# EAGLE design ChipStomp v1.1 (EAGLE 6.5.0)
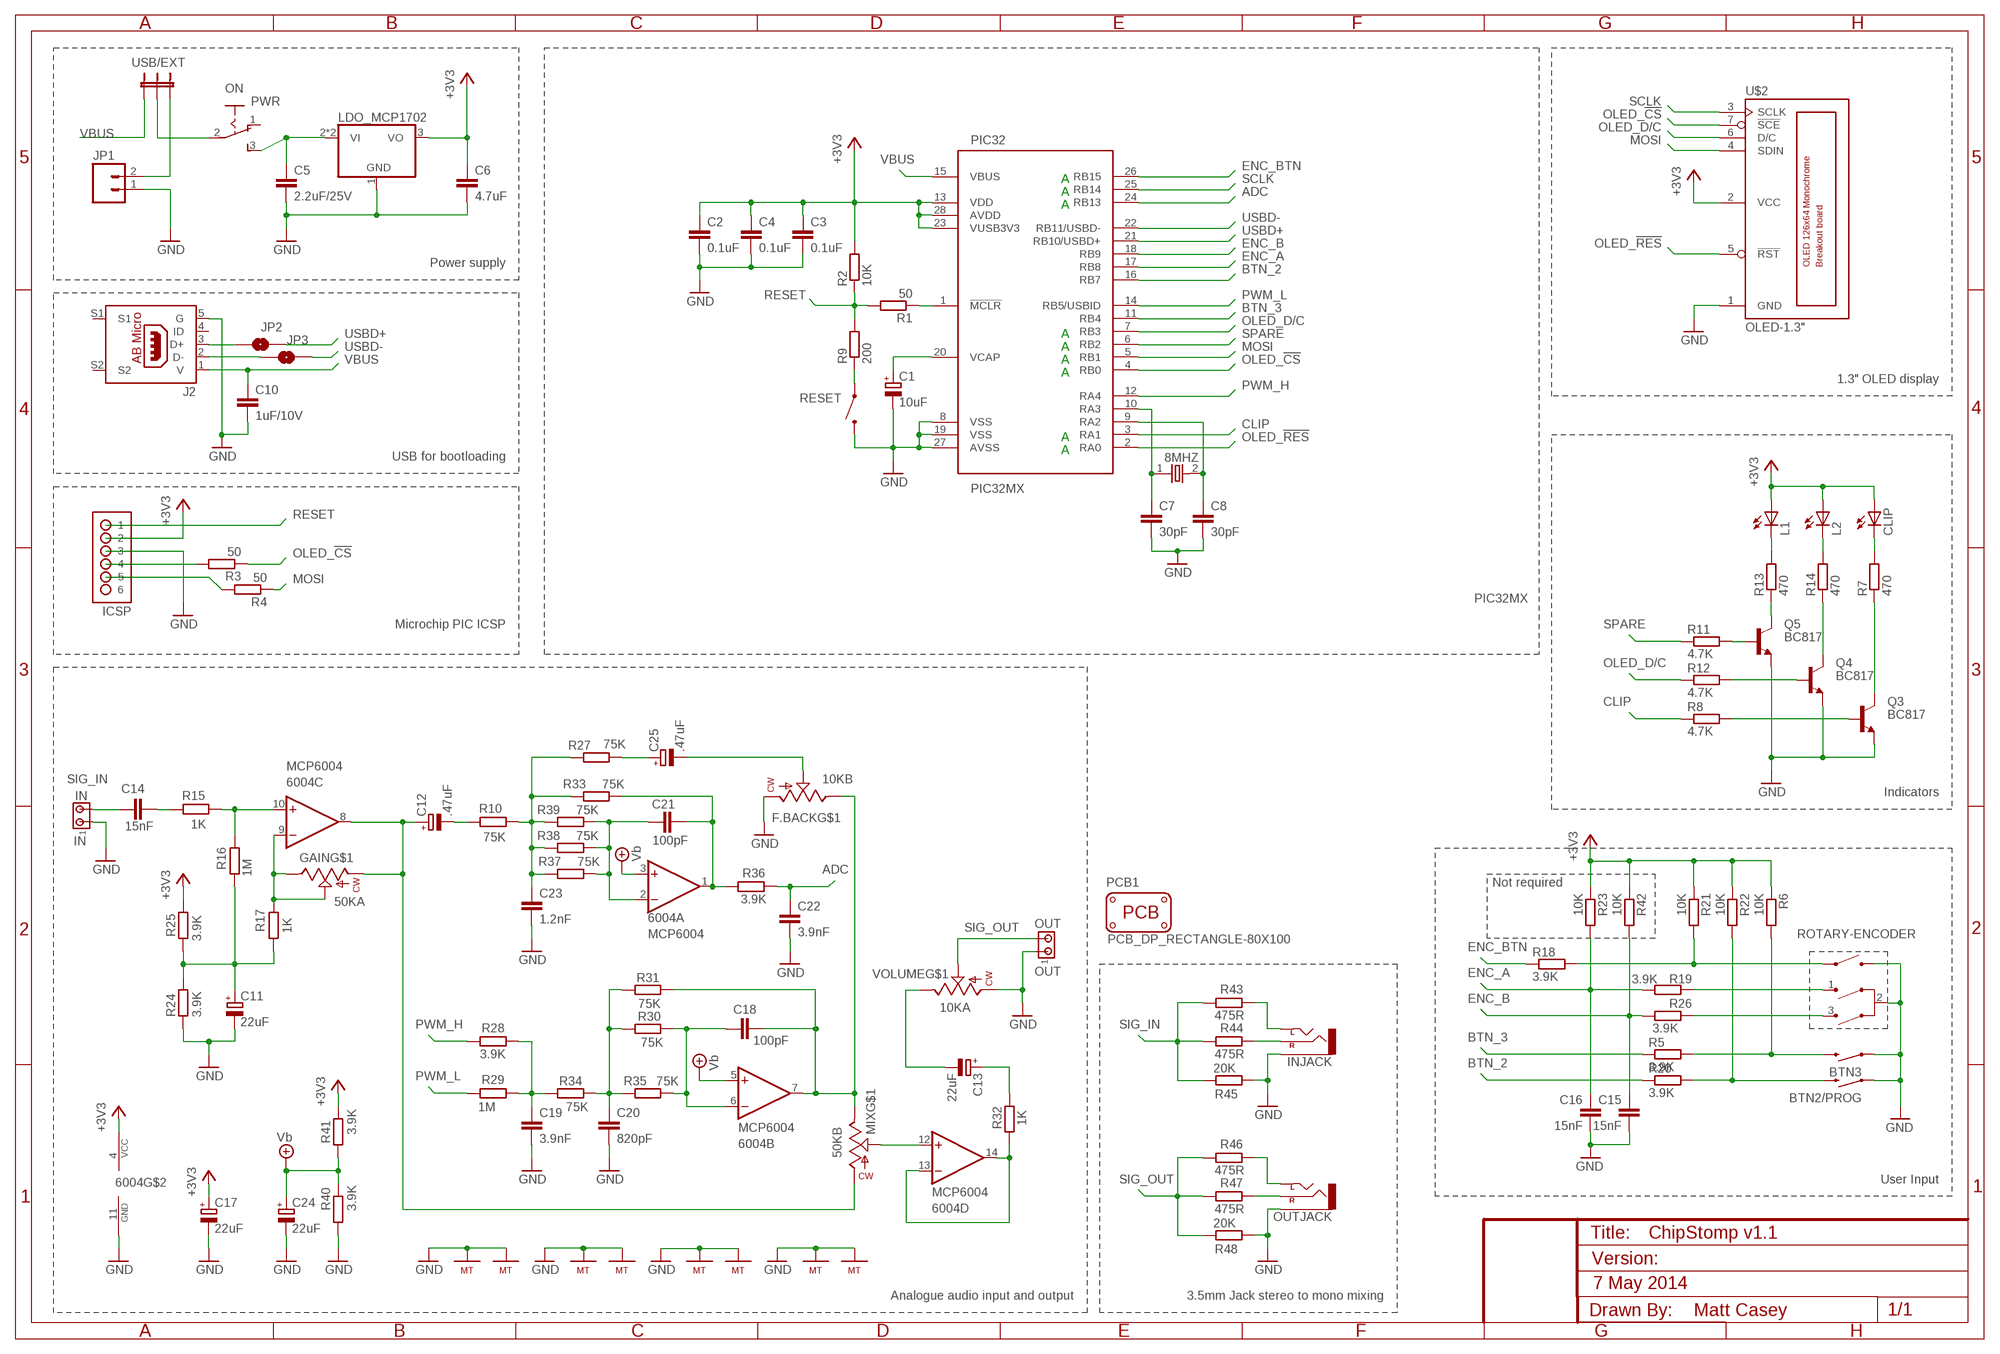
[diagram p0: schematic, sheet 1]

## Parts
8MHZ  OSC-XTAL-HC-49U-SMD  [HC-49U]
6004  MCP6004  [SO-14]
BTN2/PROG  SWITCH-MOMENTARY-212MM  [TACTILE-PTH-12MM]
BTN3  SWITCH-MOMENTARY-212MM  [TACTILE-PTH-12MM]
C1  10uF  CPOL-EUA/3216-18R  [A/3216-18R]
C2  0.1uF  C-EUC0805K  [C0805K]
C3  0.1uF  C-EUC0805K  [C0805K]
C4  0.1uF  C-EUC0805K  [C0805K]
C5  2.2uF/25V  C-EUC0805K  [C0805K]
C6  4.7uF  C-EUC0805K  [C0805K]
C7  30pF  C-EUC0805K  [C0805K]
C8  30pF  C-EUC0805K  [C0805K]
C10  1uF/10V  C-EUC0805K  [C0805K]
C11  22uF  CPOL-EU153CLV-0505  [153CLV-0505]
C12  .47uF  CPOL-EU153CLV-0405  [153CLV-0405]
C13  22uF  CPOL-EU153CLV-0505  [153CLV-0505]
C14  15nF  C-EUC0805K  [C0805K]
C15  15nF  C-EUC0805K  [C0805K]
C16  15nF  C-EUC0805K  [C0805K]
C17  22uF  CPOL-EU153CLV-0505  [153CLV-0505]
C18  100pF  C-EUC0805K  [C0805K]
C19  3.9nF  C-EUC0805K  [C0805K]
C20  820pF  C-EUC0805K  [C0805K]
C21  100pF  C-EUC0805K  [C0805K]
C22  3.9nF  C-EUC0805K  [C0805K]
C23  1.2nF  C-EUC0805K  [C0805K]
C24  22uF  CPOL-EU153CLV-0505  [153CLV-0505]
C25  .47uF  CPOL-EU153CLV-0405  [153CLV-0405]
CLIP  LED-0805  [LED-805]
F.BACK  10KB  POT  [POT/SINGLE/PANASONIC/VERT]
GAIN  50KA  POT  [POT/SINGLE/PANASONIC/VERT]
ICSP  No Load  HDR-1X6-OFFSET  [HDR-1X6_OFFSET]
IN  IN  JMP/2P/SIP  [JMP/2P/SIP]
INJACK  AUDIO-JACKPTH  [STEREO_JACK3.5MM_PTH]
J2  US-AB-MICRO-TH  [WMRU2AB-05FLB2DSR-4.0]
JP1  M023.5MM  [SCREWTERMINAL-3.5MM-2]
JP2  Straight Male  SOLDERJUMPERTRACE  [SJ_2S-TRACE]
JP3  Straight Male  SOLDERJUMPERTRACE  [SJ_2S-TRACE]
L1  LED-0805  [LED-805]
L2  LED-0805  [LED-805]
MIX  50KB  POT  [POT/SINGLE/PANASONIC/VERT]
ON  PWR  DX_MINI_SPDT  [DX_MINI_SPDT_VERTICAL]
OUT  OUT  JMP/2P/SIP  [JMP/2P/SIP]
OUTJACK  AUDIO-JACKPTH  [STEREO_JACK3.5MM_PTH]
PCB1  PCB_DP_RECTANGLE-80X100  [DP10080_V1]
PIC32  PIC32MX  PIC32MX250FXXXB  [SO-28]
Q3  BC817  BC817-16LT1SMD  [SOT23-BEC]
Q4  BC817  BC817-16LT1SMD  [SOT23-BEC]
Q5  BC817  BC817-16LT1SMD  [SOT23-BEC]
R1  50  R-EU_R0805  [R0805]
R2  10K  R-EU_R0805  [R0805]
R3  50  R-EU_R0805  [R0805]
R4  50  R-EU_R0805  [R0805]
R5  3.9K  R-EU_R0805  [R0805]
R6  10K  R-EU_R0805  [R0805]
R7  470  R-EU_R0805  [R0805]
R8  4.7K  R-EU_R0805  [R0805]
R9  200  R-EU_R0805  [R0805]
R10  75K  R-EU_R0805  [R0805]
R11  4.7K  R-EU_R0805  [R0805]
R12  4.7K  R-EU_R0805  [R0805]
R13  470  R-EU_R0805  [R0805]
R14  470  R-EU_R0805  [R0805]
R15  1K  R-EU_R0805  [R0805]
R16  1M  R-EU_R0805  [R0805]
R17  1K  R-EU_R0805  [R0805]
R18  3.9K  R-EU_R0805  [R0805]
R19  3.9K  R-EU_R0805  [R0805]
R20  3.9K  R-EU_R0805  [R0805]
R21  10K  R-EU_R0805  [R0805]
R22  10K  R-EU_R0805  [R0805]
R23  10K  R-EU_R0805  [R0805]
R24  3.9K  R-EU_R0805  [R0805]
R25  3.9K  R-EU_R0805  [R0805]
R26  3.9K  R-EU_R0805  [R0805]
R27  75K  R-EU_R0805  [R0805]
R28  3.9K  R-EU_R0805  [R0805]
R29  1M  R-EU_R0805  [R0805]
R30  75K  R-EU_R0805  [R0805]
R31  75K  R-EU_R0805  [R0805]
R32  1K  R-EU_R0805  [R0805]
R33  75K  R-EU_R0805  [R0805]
R34  75K  R-EU_R0805  [R0805]
R35  75K  R-EU_R0805  [R0805]
R36  3.9K  R-EU_R0805  [R0805]
R37  75K  R-EU_R0805  [R0805]
R38  75K  R-EU_R0805  [R0805]
R39  75K  R-EU_R0805  [R0805]
R40  3.9K  R-EU_R0805  [R0805]
R41  3.9K  R-EU_R0805  [R0805]
R42  10K  R-EU_R0805  [R0805]
R43  475R  R-EU_R0805  [R0805]
R44  475R  R-EU_R0805  [R0805]
R45  20K  R-EU_R0805  [R0805]
R46  475R  R-EU_R0805  [R0805]
R47  475R  R-EU_R0805  [R0805]
R48  20K  R-EU_R0805  [R0805]
RESET  TINY_TACTILEPTH  [TINY_TACTILE_PTH]
SW1  ROTARY-ENCODER  [SURE]
U$2  OLED-1.3"  OLED-130-BREAKOUT2HOLES  [OLED-130-BREAKOUT_2HOLES]
U$3  LDO_MCP1702  LDO_MCP1702SOT89  [SOT89]
USB/EXT  JUMPER-3PTH  [1X03]
VOLUME  10KA  POT  [POT/SINGLE/PANASONIC/VERT]

## Nets
+3V3: 6004.4(VCC) C2.1 C3.1 C4.1 C6.1 C17.+ CLIP.A ICSP.2 L1.A L2.A PIC32.13(VDD) PIC32.23(VUSB3V3) PIC32.28(AVDD) R2.2 R6.1 R21.1 R22.1 R23.1 R25.1 R41.1 R42.1 U$2.2(VCC) U$3.3(VO)
ADC: C22.1 PIC32.24(RB13) R36.1
BTN_2: PIC32.16(RB7) R20.1
BTN_3: PIC32.11(RB4) R5.1
CLIP: PIC32.3(RA1) R8.1
ENC_A: C16.1 PIC32.17(RB8) R19.1 R23.2
ENC_B: C15.1 PIC32.18(RB9) R26.1 R42.2
ENC_BTN: PIC32.26(RB15) R18.1
GND: 6004.11(GND) BTN2/PROG.1 BTN3.1 C1.- C2.2 C3.2 C4.2 C5.2 C6.2 C7.2 C8.2 C10.2 C11.- C15.2 C16.2 C17.- C19.2 C20.2 C22.2 C23.2 C24.- F.BACK.P$1 F.BACK.P$4(MT) F.BACK.P$5(MT) GAIN.P$4(MT) GAIN.P$5(MT) ICSP.3 IN.1 INJACK.S(SLEEVE) INJACK.S@1(SLEEVE) J2.5(G) JP1.1 MIX.P$4(MT) MIX.P$5(MT) OUT.1 OUTJACK.S(SLEEVE) OUTJACK.S@1(SLEEVE) PIC32.8(VSS) PIC32.19(VSS) PIC32.27(AVSS) Q3.E Q4.E Q5.E R24.2 R40.2 R45.2 R48.2 RESET.2(B) SW1.2(A:COMMON) SW1.A(B:B) U$2.1(GND) U$3.1(GND) VOLUME.P$1 VOLUME.P$4(MT) VOLUME.P$5(MT)
MOSI: PIC32.5(RB1) R4.1 U$2.4(SDIN)
N$1: PIC32.1(!MCLR) R1.1
N$3: BTN3.3 R5.2 R6.2
N$4: Q3.C R7.1
N$5: Q3.B R8.2
N$6: CLIP.C R7.2
N$7: INJACK.L(LEFT) INJACK.L@1(LEFT) R43.1
N$8: INJACK.R(RIGHT) R44.1
N$9: ON.2(P) USB/EXT.2
N$10: OUTJACK.L(LEFT) OUTJACK.L@1(LEFT) R46.1
N$11: R9.1 RESET.1(A)
N$12: C1.+ PIC32.20(VCAP)
N$13: OUTJACK.R(RIGHT) R47.1
N$15: C14.2 R15.2
N$16: JP1.2 USB/EXT.3
N$17: 6004.10(C:+IN) R15.1 R16.2
N$18: Q5.B R11.2
N$19: Q5.C R13.1
N$20: Q4.C R14.1
N$21: Q4.B R12.2
N$22: 6004.8(C:OUT) C12.+ GAIN.P$1 MIX.P$1
N$23: J2.2(D-) JP3.1
N$25: 6004.9(C:-IN) GAIN.P$2 GAIN.P$3 R17.2
N$26: L1.C R13.2
N$27: L2.C R14.2
N$28: C12.- R10.2
N$29: R18.2 R21.2 SW1.B(B:A)
N$30: BTN2/PROG.3 R20.2 R22.2
N$31: C23.1 R10.1 R27.2 R33.2 R37.2 R38.2 R39.2
N$32: 6004.2(A:-IN) C21.1 R37.1 R38.1 R39.1
N$33: 6004.1(A:OUT) C21.2 R33.1 R36.2
N$34: C11.+ R16.1 R17.1 R24.1 R25.2
N$35: C19.1 R28.1 R29.1 R34.2
N$36: C20.1 R30.2 R31.2 R34.1 R35.2
N$37: 6004.6(B:-IN) C18.1 R30.1 R35.1
N$38: C25.+ R27.1
N$39: 6004.7(B:OUT) C18.2 F.BACK.P$3 MIX.P$3 R31.1
N$40: C13.+ R32.1
N$41: C13.- VOLUME.P$3
N$43: R19.2 SW1.1(A:SIG1)
N$44: R26.2 SW1.3(A:SIG2)
N$45: C25.- F.BACK.P$2
N$47: 6004.12(D:+IN) MIX.P$2
N$48: 6004.13(D:-IN) 6004.14(D:OUT) R32.2
OLED_!CS: PIC32.4(RB0) R3.1 U$2.7(!SCE)
OLED_!RES: PIC32.2(RA0) U$2.5(!RST)
OLED_D/C: PIC32.7(RB3) R12.1 U$2.6(D/C)
OSC1/CLKI/RPA2/RA2: 8MHZ.2 C8.1 PIC32.9(RA2)
OSC2/CLKO/RPA3/PMA0/RA3: 8MHZ.1 C7.1 PIC32.10(RA3)
PGC: ICSP.5 R4.2
PGD: ICSP.4 R3.2
PWM_H: PIC32.12(RA4) R28.2
PWM_L: PIC32.14(RB5/USBID) R29.2
RESET: ICSP.1 R1.2 R2.1 R9.2
SCLK: PIC32.25(RB14) U$2.3(SCLK)
SIG_IN: C14.1 IN.2 R43.2 R44.2 R45.1
SIG_OUT: OUT.2 R46.2 R47.2 R48.1 VOLUME.P$2
SPARE: PIC32.6(RB2) R11.1
USBD+: J2.3(D+) JP2.1 JP2.2 PIC32.21(RB10/USBD+)
USBD-: JP3.2 PIC32.22(RB11/USBD-)
VBUS: C10.1 J2.1(V) PIC32.15(VBUS) USB/EXT.1
VIN: C5.1 ON.3(S) U$3.2(VI) U$3.4(VI)
VREF: 6004.3(A:+IN) 6004.5(B:+IN) C24.+ R40.1 R41.2 ; supply symbol labelled Vb
Unconnected: ICSP.6 J2.4(ID) J2.S1 J2.S2 ON.1(O)

## Notes on the sheet
- A
- A
- A
- Power supply
- A
- A
- A
- A
- 1.3" OLED display
- A
- A
- USB for bootloading
- PIC32MX
- Microchip PIC ICSP
- Indicators
- Not required
- User Input
- 7 May 2014
- Analogue audio input and output | 3.5mm Jack stereo to mono mixing
- Matt Casey

## Library data of the parts
8MHZ = dp_devices:OSC-XTAL
6004 = Catmacey:MCP6004
BTN2/PROG BTN3 = SparkFun:SWITCH-MOMENTARY-2
C1 C11-C13 C17 C24 C25 = rcl:CPOL-EU: POLARIZED CAPACITOR, European symbol
C2-C8 C10 C14-C16 C18-C23 = rcl:C-EU: CAPACITOR, European symbol
CLIP L1 L2 = dp_devices:LED: Light Emitting Diode
F.BACK GAIN MIX VOLUME = audioint:POT
ICSP = Mechanical:HDR-1X6-OFFSET: 42 mil hole pattern with 16mil offset for jtag connector
IN OUT = audioint:JMP/2P/SIP
INJACK OUTJACK = Catmacey:AUDIO-JACK: 3.5mm Audio Jack Simple 3.5mm common PCB mount audio jack. SKU: PRT-08032
J2 = Mechanical:US-AB-MICRO-TH: Through-hole USB-AB-MICRO connector
JP1 = SparkFun:M02: Header 2 Standard 2-pin 0.1" header. Use with straight break away headers (SKU : PRT-00116), right angle break away headers (PRT-00553), swiss pins (PRT-00743), machine pins (PRT-00117), and female headers (PRT-00115). Molex polarized connector foot print use with SKU : PRT-08233 with associated crimp pins and housings.
JP2 JP3 = SparkFun:SOLDERJUMPER: Solder Jumper Standard SMD solder jumper. Used to automate production. Two varients : Normally Open and Normally Closed are the same, but have different paste layers. NC will have a large amount of paste and should jumper during reflow.
ON = Catmacey:DX_MINI_SPDT: SLIDING SWITCH SPDT Odd pin spacing 4.8mm bought from Deal Extreme Here <http://dx.com/p/3-pin-slide-switch-diy-parts-black-silver-20-piece-pack-134100?item=276>
PCB1 = dp_devices:PCB_DP_RECTANGLE: Dangerous Prototypes Standard Rectangular PCB sizes
PIC32 = Catmacey:PIC32MX250FXXXB
Q3-Q5 = transistor-npn:BC817*: NPN Transistor
R1-R48 = rcl:R-EU_: RESISTOR, European symbol
RESET = Catmacey:TINY_TACTILE: DIL/CODE SWITCH
SW1 = Catmacey:ROTARY-ENCODER: 11mm Incemental Encoder Source: www.piher.net .. 04-CI-11v04.pdf
U$2 = Catmacey:OLED-130-BREAKOUT
U$3 = Catmacey:LDO_MCP1702
USB/EXT = SparkFun:JUMPER-3

## Board
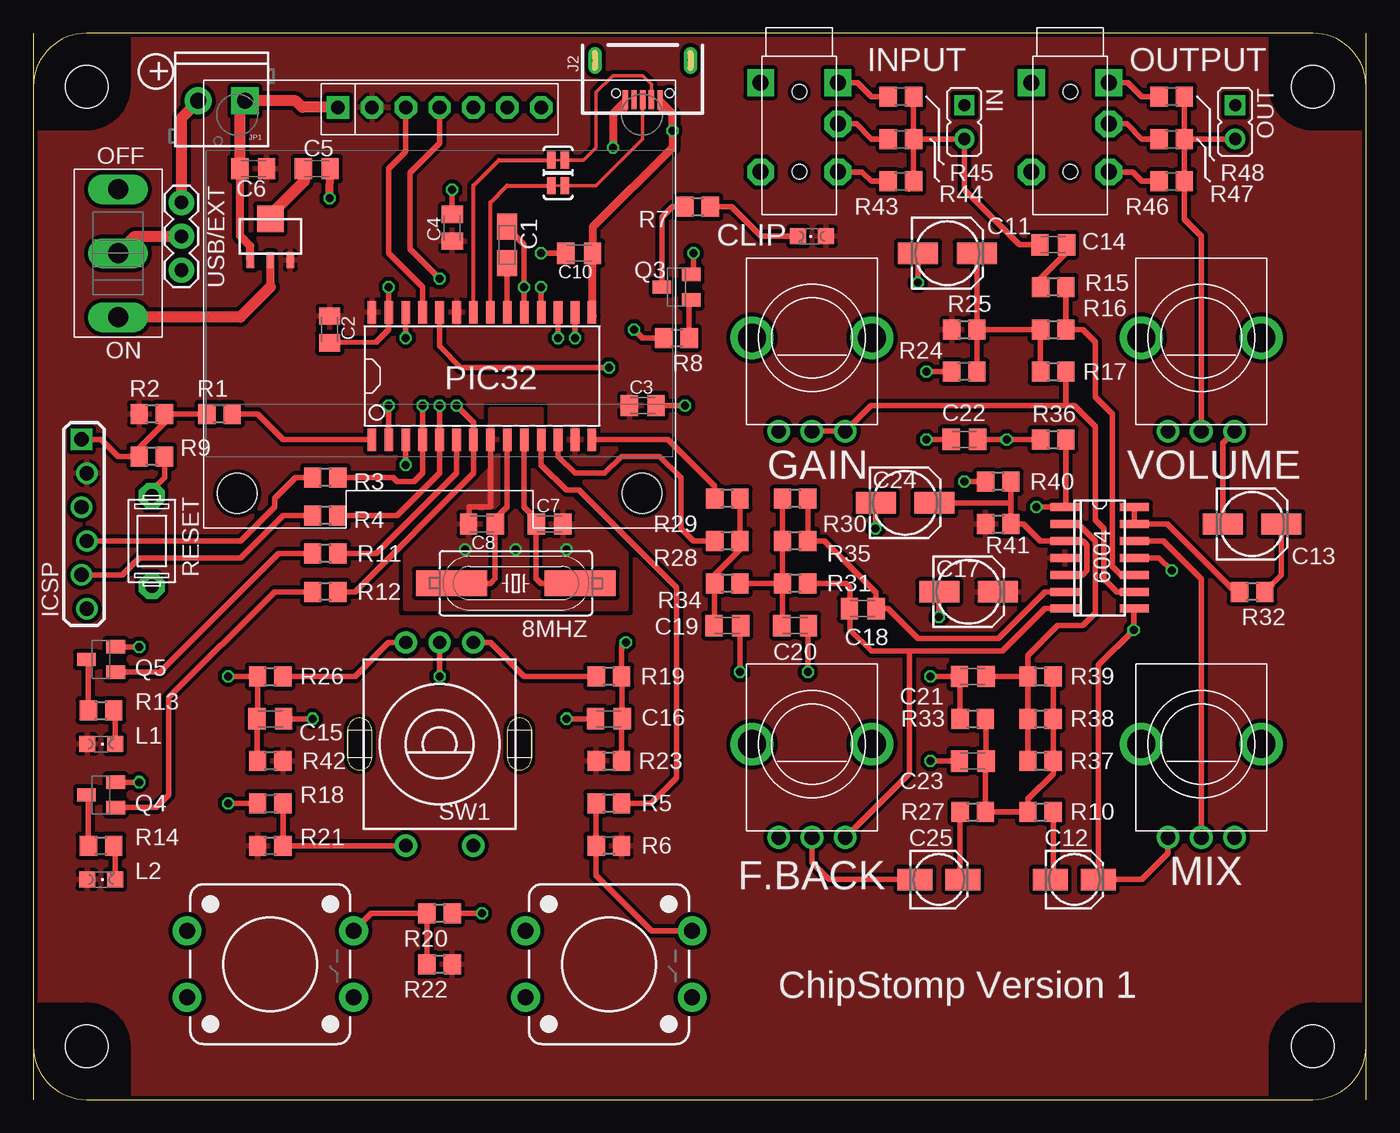
[diagram p1: board, top side]
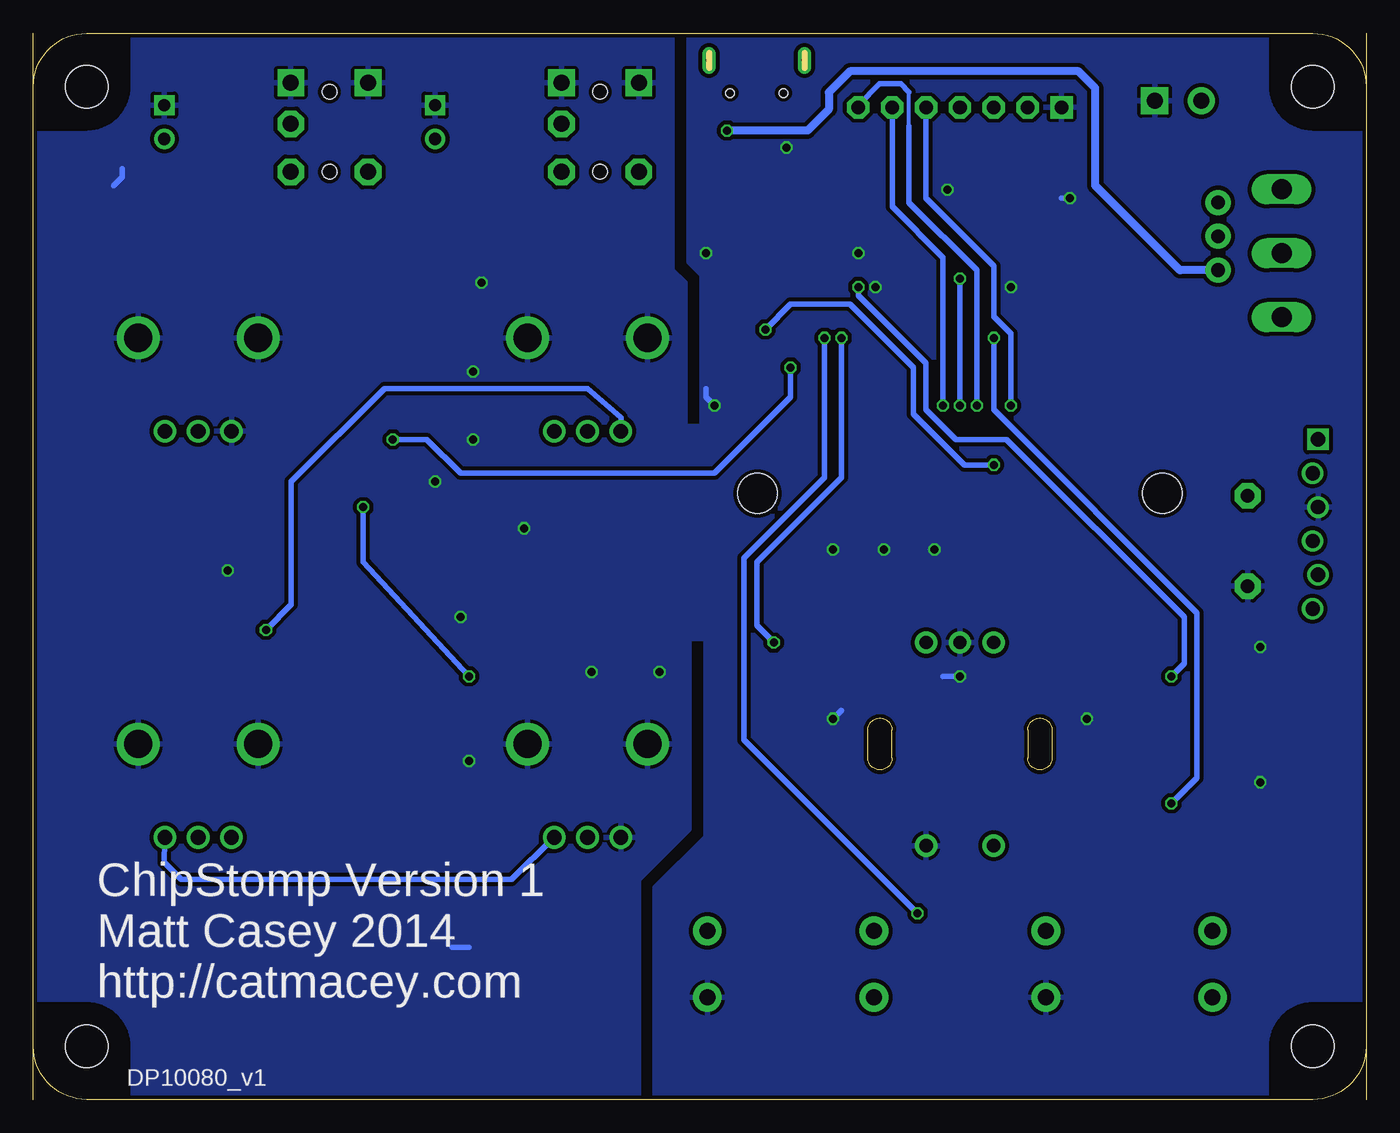
[diagram p2: board, bottom side, seen from below]

Size 100 x 80 mm. Coordinates in mm from the lower left corner, seen from the top.
Outline: 100,0 100,80
Outline: 0,80 0,0
Copper layers (1*16): Top 0.035mm / dielectric 1.5mm / Bottom 0.035mm
Design rules "dirt_cheap_dirty_boards.v1": minimum track width 5mil, minimum drill 12mil, track to track 5mil, track to pad 5mil, pad to pad 5mil, via to via 5mil, smd to smd 0mil, copper to edge 10mil, drill to drill 10mil, minimum pad ring 10mil, minimum via ring 6mil, stop-mask expansion 2mil, vias tented up to drill 25mil, thermal gap 10mil

### Footprints (pad centres in the part's own frame; a part is rotated, then mirrored left to right if it is on the bottom)
HC-49U = smd 5.334 x 1.93: 1 -4.826,0; 2 4.826,0
SO-14 = smd 0.6 x 2.2: 1 -3.81,-2.6; 2 -2.54,-2.6; 3 -1.27,-2.6; 4 0,-2.6; 5 1.27,-2.6; 6 2.54,-2.6; 7 3.81,-2.6; 8 3.81,2.6; 9 2.54,2.6; 10 1.27,2.6; 11 0,2.6; 12 -1.27,2.6; 13 -2.54,2.6; 14 -3.81,2.6
TACTILE-PTH-12MM = drill 1.2 pad 2.159: 1 6.25,-2.5; 2 -6.25,-2.5; 3 6.25,2.5; 4 -6.25,2.5
A/3216-18R = smd 1.95 x 1.5: + 1.375,0; - -1.375,0
C0805K = smd 1.3 x 1.6: 1 -1,0; 2 1,0
153CLV-0505 = smd 3 x 1.6: + 2.2,0; - -2.2,0
153CLV-0405 = smd 2.6 x 1.6: + 1.8,0; - -1.8,0
LED-805 = smd 1.2 x 1.2: A 0,-1.05; C 0,1.05
POT/SINGLE/PANASONIC/VERT = drill 1.092 pad 1.7: P$1 -2.5,-7; P$2 0,-7; P$3 2.5,-7 | drill 2.108 pad 3.2: P$4 -4.5,0; P$5 4.5,0
HDR-1X6_OFFSET = drill 1.067 square: 1 -0.203,6.35 | drill 1.067: 2 0.203,3.81; 3 -0.203,1.27; 4 0.203,-1.27; 5 -0.203,-3.81; 6 0.203,-6.35
JMP/2P/SIP = drill 0.914 pad 1.524 square: 1 -1.27,0 | drill 0.914 pad 1.524: 2 1.27,0
STEREO_JACK3.5MM_PTH = drill 1.2 pad 2 octagon: L -2.9,-6.6; L@1 2.9,-6.6; R 2.9,-3 | drill 1.2 pad 2 square: S -2.9,0.1; S@1 2.9,0.1 | hole 1.1: 0,-6.6; 0,-0.6
WMRU2AB-05FLB2DSR-4.0 = smd 0.4 x 1.4: 1 -1.3,1.5; 2 -0.65,1.5; 3 0,1.5; 4 0.65,1.5; 5 1.3,1.5 | drill 0.45 pad 1 long: S1 -3.58,-1.45; S2 3.58,-1.45 | hole 0.65: -2,1; 2,1
SCREWTERMINAL-3.5MM-2 = drill 1.2 pad 2.032 square: 1 0,0 | drill 1.2 pad 2.032: 2 3.5,0
SJ_2S-TRACE = smd 0.635 x 1.27: 1 -0.508,0; 2 0.508,0
DX_MINI_SPDT_VERTICAL = drill 1.5 long: 1 -4.8,0; 2 0,0; 3 4.8,0
DP10080_V1 = hole 3.2: 4,4; 96,4; 96,76; 4,76
SO-28 = smd 0.65 x 1.7: 1 -8.89,-4.78; 2 -7.62,-4.78; 3 -6.35,-4.78; 4 -5.08,-4.78; 5 -3.81,-4.78; 6 -2.54,-4.78; 7 -1.27,-4.78; 8 0,-4.78; 9 1.27,-4.78; 10 2.54,-4.78; 11 3.81,-4.78; 12 5.08,-4.78; 13 6.35,-4.78; 14 7.62,-4.78; 15 7.62,4.78; 16 6.35,4.78; 17 5.08,4.78; 18 3.81,4.78; 19 2.54,4.78; 20 1.27,4.78; 21 0,4.78; 22 -1.27,4.78; 23 -2.54,4.78; 24 -3.81,4.78; 25 -5.08,4.78; 26 -6.35,4.78; 27 -7.62,4.78; 28 -8.89,4.78
SOT23-BEC = smd 1 x 1.4: B -0.95,-1.1; C 0,1.1; E 0.95,-1.1
R0805 = smd 1.3 x 1.5: 1 -0.95,0; 2 0.95,0
TINY_TACTILE_PTH = drill 1.016 pad 1.93 octagon: 1 0,-3.393; 2 0,3.393
SURE = drill 1 pad 1.676: 1 -2.54,-7.62; 2 0,-7.62; 3 2.54,-7.62; A -2.54,7.62; B 2.54,7.62
OLED-130-BREAKOUT_2HOLES = drill 1.016 pad 1.676 square: 1 -7.62,14.75 | drill 1.016 pad 1.676 octagon: 2 -5.08,14.75; 3 -2.54,14.75; 4 0,14.75; 5 2.54,14.75; 6 5.08,14.75; 7 7.62,14.75 | hole 3: -15.19,-14.21; 15.19,-14.21
SOT89 = smd 0.58 x 1.2: 1 -1.5,-1.8; 2 0,-1.8; 3 1.5,-1.8 | smd 2 x 2: 4 0,1.3
1X03 = drill 1.016 pad 1.88: 1 0,0; 2 2.54,0; 3 5.08,0

### Placement (x,y rotation side)
8MHZ  36.2,38.73 180 top
6004  80.01,40.64 270 top
BTN2/PROG  17.78,10.16 0 top
BTN3  43.18,10.16 0 top
C1  35.56,64.14 270 top
C2  22.23,57.78 270 top
C3  45.72,52.07 0 top
C4  31.43,65.41 90 top
C5  21.27,69.85 0 top
C6  16.51,69.85 180 top
C7  38.73,43.18 0 top
C8  33.66,43.18 180 top
C10  40.96,63.5 180 top
C11  68.58,63.5 0 top
C12  78.11,16.51 0 top
C13  91.44,43.18 0 top
C14  76.52,64.14 0 top
C15  17.78,28.57 0 top
C16  43.18,28.57 180 top
C17  70.17,38.1 0 top
C18  62.23,36.83 180 top
C19  52.07,35.56 0 top
C20  57.15,35.56 0 top
C21  70.48,31.75 180 top
C22  69.85,49.53 180 top
C23  70.48,25.4 180 top
C24  65.41,44.77 0 top
C25  67.94,16.51 0 top
CLIP  58.42,64.77 90 top
F.BACK  58.42,26.67 0 top
GAIN  58.42,57.15 0 top
ICSP  3.81,43.18 0 top
IN  69.85,73.34 270 top
INJACK  57.47,76.2 0 top
J2  45.72,76.52 180 top
JP1  15.88,74.93 180 top
JP2  39.37,68.58 180 top
JP3  39.37,70.48 180 top
L1  5.08,26.67 270 top
L2  5.08,16.51 270 top
MIX  87.63,26.67 0 top
ON  6.35,63.5 270 top
OUT  90.17,73.34 270 top
OUTJACK  77.79,76.2 0 top
PCB1  0,0 0 top
PIC32  34.29,54.29 0 top
Q3  48.26,60.96 90 top
Q4  5.08,22.86 90 top
Q5  5.08,33.02 90 top
R1  13.97,51.44 180 top
R2  8.89,51.44 180 top
R3  21.91,46.67 180 top
R4  21.91,43.81 180 top
R5  43.18,22.23 180 top
R6  43.18,19.05 180 top
R7  49.85,66.99 0 top
R8  48.26,57.15 0 top
R9  8.89,48.26 180 top
R10  75.56,21.59 0 top
R11  21.91,40.96 180 top
R12  21.91,38.1 180 top
R13  5.08,29.21 0 top
R14  5.08,19.05 0 top
R15  76.52,60.96 180 top
R16  76.52,57.78 0 top
R17  76.52,54.61 0 top
R18  17.78,22.23 0 top
R19  43.18,31.75 180 top
R20  30.48,13.97 180 top
R21  17.78,19.05 0 top
R22  30.48,10.16 180 top
R23  43.18,25.4 0 top
R24  69.85,54.61 180 top
R25  69.85,57.78 0 top
R26  17.78,31.75 0 top
R27  70.48,21.59 0 top
R28  52.07,41.91 180 top
R29  52.07,45.09 180 top
R30  57.15,45.09 180 top
R31  57.15,38.73 180 top
R32  91.44,38.1 180 top
R33  70.48,28.57 0 top
R34  52.07,38.73 180 top
R35  57.15,41.91 180 top
R36  76.52,49.53 0 top
R37  75.56,25.4 0 top
R38  75.56,28.57 0 top
R39  75.56,31.75 0 top
R40  72.39,46.35 180 top
R41  72.39,43.18 0 top
R42  17.78,25.4 180 top
R43  65.09,68.9 0 top
R44  65.09,72.07 0 top
R45  65.09,75.25 180 top
R46  85.41,68.9 0 top
R47  85.41,72.07 0 top
R48  85.41,75.25 180 top
RESET  8.89,41.91 180 top
SW1  30.48,26.67 180 top
U$2  30.48,59.69 0 top
U$3  17.78,64.77 0 top
USB/EXT  11.11,62.23 90 top
VOLUME  87.63,57.15 0 top

### Tracks (layer width: path | path; a pad name or v marks a point on that pad's centre or on a via)
+3V3
  pour Top (isolate 0.305, rank 6): 0,80.01 49.53,80.01 51.44,80.01 99.69,80.01 100.33,0 55.88,0 54.61,0 0,0
ADC  (via drill 0.6)
  Top 0.406: C22.1 v73.03,49.53 R36.1 | v43.18,54.93 32.07,54.93 30.48,56.52 PIC32.24
  Bottom 0.406: v43.18,54.93 43.18,52.7 48.9,46.99 67.94,46.99 70.48,49.53 v73.03,49.53
BTN_2  (via drill 0.6)
  Top 0.406: PIC32.16 v40.64,57.15 | v33.66,13.97 R20.1
  Bottom 0.406: v40.64,57.15 40.64,46.67 46.67,40.64 46.67,26.99 v33.66,13.97
BTN_3
  Top 0.406: PIC32.11 38.1,47.62 40.01,45.72 40.96,45.72 48.26,38.42 48.26,24.13 46.35,22.23 R5.1
CLIP  (via drill 0.6)
  Top 0.406: R8.1 45.72,57.15 v45.09,57.78 | PIC32.3 v27.94,47.62
  Bottom 0.406: v27.94,47.62 30.16,47.62 33.97,51.44 33.97,54.93 38.73,59.69 43.18,59.69 v45.09,57.78
ENC_A  (via drill 0.6)
  Top 0.406: PIC32.17 v39.37,57.15 | R23.2 44.13,28.52 C16.1 44.18,31.7 R19.1 44.13,33.97 v44.45,34.29
  Bottom 0.406: v39.37,57.15 39.37,46.67 45.72,40.32 45.72,35.56 v44.45,34.29
ENC_B  (via drill 0.6)
  Top 0.406: R42.2 16.78,25.45 C15.1 16.83,28.62 R26.1 v14.61,31.75 | PIC32.18 v38.1,60.96
  Bottom 0.406: v38.1,60.96 38.1,60.33 33.02,55.24 33.02,51.75 30.8,49.53 26.99,49.53 13.65,36.2 13.65,32.7 v14.61,31.75
ENC_BTN  (via drill 0.6)
  Top 0.406: PIC32.26 v27.94,57.15 | R18.1 v14.61,22.23
  Bottom 0.406: v14.61,22.23 12.7,24.13 12.7,36.51 27.94,51.75 v27.94,57.15
GND  (via drill 0.6)
  Top 0.305: 44.45,74.61 44.13,74.3 | 44.45,74.3 44.13,74.3 | 44.13,74.3 43.5,73.66
  Top 0.406: v67.31,25.4 C23.2 | C22.2 v66.99,49.53 | C17.- 67.94,38.12 v67.94,36.2 | R40.2 v69.85,46.35 | C24.- 63.18,44.74 v63.18,42.86 | C20.2 58.1,35.51 v58.1,32.07 | 6004.11 84.45,40.64 v85.41,39.69 | R24.2 v66.99,54.61 | C11.- 66.36,63.16 v66.36,61.28 | PIC32.8 34.29,44.45 32.7,44.45 32.7,43.23 C8.2 | C10.2 v38.1,63.5 | C5.2 21.91,69.8 | 32.66,41.32 32.7,41.27 | PIC32.19 v36.83,60.96 36.83,64.14 35.56,65.41 C1.- | v26.67,60.96 PIC32.27 26.67,57.78 25.72,56.83 C2.2 | C4.2 v31.43,68.26 | SW1.2 v30.48,31.75 | v20.95,28.57 C15.2 | C16.2 v40.01,28.57 | C19.2 53.02,35.51 v53.02,32.07 | C3.2 v48.9,52.07 | Q3.E 49.53,62.08 v49.53,63.5 | Q5.E v7.94,33.97 | Q4.E v7.94,23.81 | J2.5 43.5,74.09 43.5,73.98 43.81,74.3 44.13,74.3 | R45.2 62.87,75.25 61.81,76.3 INJACK.S@1 | R48.2 83.19,75.25 82.13,76.3 OUTJACK.S@1
  Top 0.61: 43.5,73.98 43.5,73.66 v43.5,71.44 | U$3.1 16.28,64.05 15.51,64.82 C6.2 | v22.23,67.63 C5.2
  Top 0.813: U$2.1 20.18,74.44 19.68,74.93 JP1.1 15.51,74.56 C6.2
  Bottom 0.406: 68.58,11.43 67.31,11.43 | 93.34,69.85 93.34,69.22 93.98,68.58 | v22.23,67.63 22.86,67.63 | 32.7,41.27 v32.38,41.27 | v30.48,31.75 31.75,31.75 | v40.01,28.57 39.37,29.21 | v48.9,52.07 49.53,52.7 49.53,53.34
  other vias: 40.01,41.27 36.2,41.27
  pour Bottom (isolate 0.305): 0,80.01 0,0 53.34,0 53.34,15.88 49.53,19.68 49.53,34.61 50.8,34.61 50.8,20.32 54.61,16.51 54.61,0 101.6,0 101.6,80.01 52.07,80.01 52.07,62.23 51.12,61.28 51.12,50.48 49.85,50.48 49.85,61.91 50.8,62.87 50.8,80.01
  pour Top (isolate 0.305): 27.94,36.83 44.45,36.83 44.45,40.96 38.1,47.31 38.1,51.75 34.29,51.75 34.29,47.31 27.94,40.96
MOSI  (via drill 0.6)
  Top 0.406: v30.48,52.07 PIC32.5 30.48,46.99 27.3,43.81 R4.1 | U$2.4 30.48,71.75 28.26,69.53 28.26,63.82 v30.48,61.59
  Bottom 0.406: v30.48,61.59 v30.48,52.07
N$1
  Top 0.406: R1.1 16.83,51.44 18.75,49.51 PIC32.1
N$3
  Top 0.406: R5.2 R6.2 42.23,16.83 46.4,12.66 BTN3.3
N$4
  Top 0.406: Q3.C 47.16,66.21 47.94,66.99 R7.1
N$5
  Top 0.406: Q3.B 49.21,59.86 R8.2
N$6
  Top 0.406: R7.2 52.39,66.99 54.61,64.77 CLIP.C
N$7
  Top 0.406: R43.1 62.87,68.9 62.16,69.6 INJACK.L@1
N$8
  Top 0.406: R44.1 62.87,72.07 61.74,73.2 INJACK.R
N$9
  Top 0.813: ON.2 7.62,64.77 USB/EXT.2
N$10
  Top 0.406: R46.1 83.19,68.9 82.48,69.6 OUTJACK.L@1
N$11
  Top 0.406: RESET.1 8.89,45.72 9.84,46.67 R9.1
N$12
  Top 0.406: PIC32.20 C1.+
N$13
  Top 0.406: R47.1 83.19,72.07 82.06,73.2 OUTJACK.R
N$15
  Top 0.305: 75.56,61.59 R15.2
  Top 0.406: C14.2 77.52,63.55 75.56,61.59 | R15.2
N$16
  Top 0.813: USB/EXT.3 11.11,73.67 JP1.2
N$17
  Top 0.406: 6004.10 81.6,39.37 80.96,40.01 80.96,51.44 79.69,52.7 79.69,56.83 78.74,57.78 R16.2 R15.1
N$18
  Top 0.406: R11.2 18.41,40.96 9.53,32.07 Q5.B
N$19
  Top 0.406: Q5.C 4.13,33.02 R13.1
N$20
  Top 0.406: Q4.C 4.13,22.86 R14.1
N$21
  Top 0.406: R12.2 18.1,38.1 10.16,30.16 10.16,22.86 9.21,21.91 Q4.B
N$22  (via drill 0.6)
  Top 0.406: MIX.P$1 85.13,18.45 83.19,16.51 C12.+ 79.91,32.6 v82.55,35.24 82.55,36.77 6004.8
  Bottom 0.406: v82.55,35.24 80.64,37.15 80.64,46.35 73.66,53.34 58.42,53.34 55.92,51.16 GAIN.P$1 55.92,50.12
N$23
  Top 0.254: JP3.1 41.27,70.48 42.23,71.44 42.23,75.56 43.5,76.83 45.72,76.83 46.37,76.19 J2.2
N$25
  Top 0.305: 77.47,52.07 77.15,52.07
  Top 0.406: GAIN.P$2 GAIN.P$3 62.84,52.07 77.15,52.07 78.11,52.07 79.69,50.48 79.69,43.5 80.33,42.86 80.33,39.05 81.28,38.1 6004.9 | R17.2 77.47,52.07
N$26
  Top 0.406: R13.2 6.13,29.21 L1.C
N$27
  Top 0.406: R14.2 6.13,19.05 L2.C
N$28
  Top 0.406: 76.83,16.72 C12.- 76.52,16.72 R10.2
N$29
  Top 0.406: SW1.B R21.2 R18.2
N$30
  Top 0.406: BTN2/PROG.3 25.34,13.97 R20.2 R22.2
N$31
  Top 0.406: R33.2 71.48,28.52 C23.1 71.44,25.35 R27.2 R10.1 74.61,22.54 76.52,24.45 R37.2 R38.2 R39.2
N$32
  Top 0.406: 6004.2 78.42,43.18 79.69,41.91 79.69,36.51 78.74,35.56 76.83,35.56 74.61,33.34 R39.1 | C21.1 R39.1 | R39.1 R38.1 R37.1
N$33  (via drill 0.6)
  Top 0.406: R36.2 77.47,49.21 77.47,46.99 77.47,44.45 6004.1 v75.25,44.45 | v67.31,31.75 C21.2 69.53,31.7 R33.1
  Bottom 0.406: v67.31,31.75 75.25,40.32 v75.25,44.45
N$34
  Top 0.406: R24.1 R25.2 | R25.2 R16.1 R17.1 | C11.+ 70.78,57.8 R25.2
N$35
  Top 0.406: C19.1 51.12,35.61 R34.2 51.12,39.37 53.02,41.27 R28.1 R29.1
N$36
  Top 0.406: R31.2 56.2,35.61 arc-90 C20.1 | R34.1 R31.2 | R31.2 R35.2 R30.2
N$37
  Top 0.406: 6004.6 75.88,38.1 72.39,34.61 66.36,34.61 64.14,36.83 C18.1 63.23,38.05 59.37,41.91 R35.1 R30.1
N$38
  Top 0.406: R27.1 69.53,17.14 69.75,16.93 C25.+
N$39
  Top 0.406: 6004.7 75.88,36.83 72.71,33.66 65.72,33.66 | 65.72,33.66 62.87,33.66 61.28,35.24 61.28,36.78 C18.2 61.28,36.88 61.28,38.42 60.96,38.73 R31.1 | F.BACK.P$3 65.72,24.47 65.72,33.66
  Bottom 0.406: 90.13,19.73 MIX.P$3 90.13,19.41 90.17,17.78 88.9,16.51 64.11,16.51 F.BACK.P$3
N$40
  Top 0.406: R32.1 93.64,39.35 C13.+
N$41
  Top 0.406: C13.- 89.24,49.26 VOLUME.P$3
N$43
  Top 0.406: SW1.1 34.29,34.29 36.83,31.75 R19.2
N$44
  Top 0.406: SW1.3 26.67,34.29 24.13,31.75 R26.2
N$45
  Top 0.406: F.BACK.P$2 58.42,17.78 59.69,16.51 C25.-
N$47
  Top 0.406: MIX.P$2 87.63,39.05 84.77,41.91 6004.12
N$48
  Top 0.406: 82.55,44.51 6004.14 6004.13 85.09,43.18 90.17,38.1 R32.2
OLED_!CS  (via drill 0.6)
  Top 0.406: R3.1 26.99,46.67 27.3,46.35 28.57,46.35 29.21,46.99 PIC32.4 v29.21,52.07
  Bottom 0.305: 34.29,73.03 34.29,75.56
  Bottom 0.406: v29.21,52.07 29.21,62.23 34.29,67.31 34.29,73.03 | 34.29,75.56 34.92,76.2 36.51,76.2 38.1,74.61 U$2.7
OLED_!RES  (via drill 0.6)
  Top 0.406: PIC32.2 v26.67,52.07
  Bottom 0.406: v26.67,52.07 26.67,57.47 27.94,58.74 27.94,62.55 33.02,67.63 U$2.5
OLED_D/C  (via drill 0.6)
  Top 0.406: R12.1 24.13,38.1 33.02,46.99 PIC32.7 33.02,50.8 v31.75,52.07
  Bottom 0.406: v31.75,52.07 31.75,63.18 35.56,66.99 U$2.6
OSC1/CLKI/RPA2/RA2
  Top 0.406: 8MHZ.2 34.29,38.73 34.66,39.1 C8.1 34.66,43.55 35.56,44.45 PIC32.9
OSC2/CLKO/RPA3/PMA0/RA3
  Top 0.406: C7.1 37.73,43.45 | C7.1 37.73,39.1 38.1,38.73 8MHZ.1 | PIC32.10 36.83,44.45 37.73,43.55 C7.1
PGC
  Top 0.406: R4.2 18.73,43.81 15.56,40.64 7.94,40.64 6.67,39.37 ICSP.5
PGD
  Top 0.406: R3.2 19.68,46.67 18.1,45.09 18.1,44.45 15.56,41.91 ICSP.4
PWM_H
  Top 0.406: PIC32.12 39.37,48.26 40.64,46.99 42.86,46.99 44.13,48.26 46.99,48.26 48.58,46.67 48.58,42.86 49.53,41.91 R28.2
PWM_L
  Top 0.406: PIC32.14 41.93,49.53 47.62,49.53 51.12,46.03 R29.2
RESET
  Top 0.406: ICSP.1 5.08,49.53 6.35,48.26 R9.2 7.94,48.9 9.84,50.8 R2.1 R1.2
SCLK
  Top 0.406: U$2.3 27.94,71.12 26.67,69.85 26.67,63.5 29.21,60.96 PIC32.25
SIG_IN
  Top 0.305: 65.72,68.89 65.72,68.26
  Top 0.406: R45.1 R44.2 | R44.2 R43.2 65.72,68.89 | R44.2 IN.2 69.85,68.26 73.98,64.14 C14.1
SIG_OUT
  Top 0.406: R47.2 OUT.2 | R47.2 R46.2 86.36,66.04 87.63,64.77 VOLUME.P$2 | R48.1 R47.2
SPARE
  Top 0.406: PIC32.6 31.75,46.99 25.72,40.96 R11.1
USBD+
  Top 0.203: JP2.2 JP2.1
  Top 0.254: J2.3 45.72,72.07 42.23,68.58 JP2.1
  Top 0.305: PIC32.21 34.29,67.31 35.56,68.58 JP2.2
USBD-
  Top 0.305: PIC32.22 33.02,68.58 34.92,70.48 JP3.2
VBUS  (via drill 0.6)
  Top 0.305: 46.99,74.61 47.31,74.3 | 46.99,74.3 47.31,74.3 | 47.31,74.3 47.94,73.66
  Top 0.406: PIC32.15 41.96,58.8 | J2.1 47.94,74.09 47.94,73.98 47.31,74.3
  Top 0.61: 47.94,73.98 47.94,73.66 v47.94,72.71 47.94,71.44 41.96,65.45 C10.1 41.96,58.8
  Bottom 0.61: USB/EXT.1 13.97,62.23 20.32,68.58 20.32,75.88 21.59,77.15 38.73,77.15 40.32,75.56 40.32,74.3 41.91,72.71 v47.94,72.71
VIN
  Top 0.406: C5.1 20.32,69.48 | 17.78,66.36 U$3.4
  Top 0.61: U$3.2 17.78,60.96
  Top 0.813: 17.78,60.96 15.52,58.7 ON.3 | 20.32,69.48 20.32,68.9 17.78,66.36
VREF
  Top 0.406: 6004.5 78.74,39.37 79.06,39.69 79.06,41.59 78.74,41.91 6004.3 75.56,41.91 74.3,43.18 R41.2 R40.1 73.34,44.45 73.34,44.77 C24.+

### Text on the board
tPlace: INPUT | OUTPUT | + | OFF | ChipStomp Version 1
bPlace: ChipStomp Version 1 | Matt Casey 2014 | http://catmacey.com